# Altium schematic sheet Sheet1.SchDoc
size 241 x 139 mm
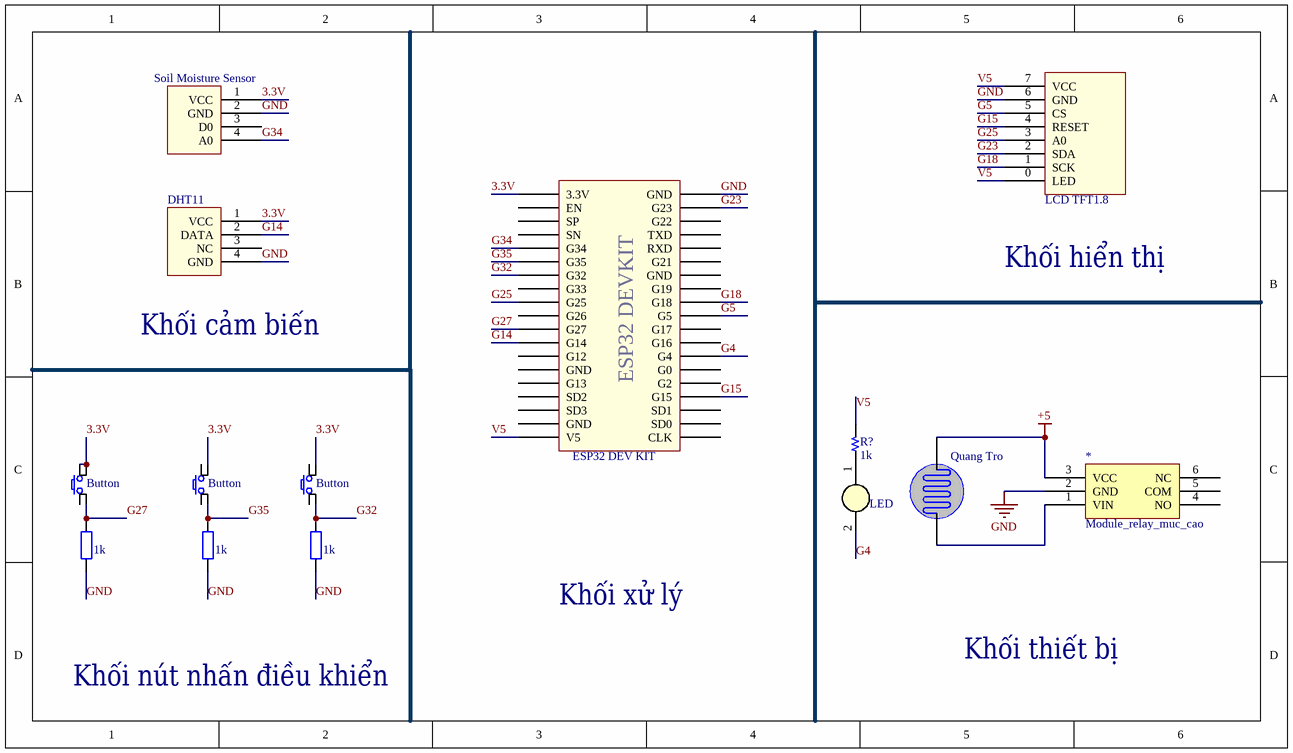
[diagram p0: Sheet1.SchDoc]

## Parts
(Parts that share a designator on the sheet are numbered #1, #2 ... from top to bottom, then left to right.)
*  Module_relay_muc_cao
?#1  LCD TFT1.8
?#2  Soil Moisture Sensor
?#3  DHT11
?#4  ESP32 DEV KIT  [ESP32 DEVKIT]
?#5  LED  [LED-3MM-WHITE]
?#6  Quang Tro  [Quang Tro]
?#7  Button  [SW/4/06MM]
?#8  Button  [SW/4/06MM]
?#9  Button  [SW/4/06MM]
?#10  1k  [tro vach 1/2w]
?#11  1k  [tro vach 1/2w]
?#12  1k  [tro vach 1/2w]
R?  1k  [R 0805]

## Nets
+5: *.3(VCC) ?#6.1
GND: *.2(GND) ?#1.6(GND) ?#2.2(GND) ?#3.4(GND) ?#4.38(GND) ?#10.1 ?#11.1 ?#12.1
3.3V: ?#2.1(VCC) ?#3.1(VCC) ?#4.1(3.3V) ?#7.3 ?#7.4 ?#8.4 ?#9.4
G4: ?#4.26(G4) ?#5.2(K)
G5: ?#1.5(CS) ?#4.29(G5)
G14: ?#3.2(DATA) ?#4.12(G14)
G15: ?#1.4(RESET) ?#4.23(G15)
G18: ?#1.1(SCK) ?#4.30(G18)
G23: ?#1.2(SDA) ?#4.37(G23)
G25: ?#1.3(A0) ?#4.9(G25)
G27: ?#4.11(G27) ?#7.2 ?#10.2
G32: ?#4.7(G32) ?#9.2 ?#12.2
G34: ?#2.4(A0) ?#4.5(G34)
G35: ?#4.6(G35) ?#8.2 ?#11.2
V5: ?#1.0(LED) ?#1.7(VCC) ?#4.19(V5) R?.2
Net*_1: *.1(VIN) ?#6.2
Net?#5_1: ?#5.1(A) R?.1

Not connected (* = marked no-connect by the designer): * 4(NO) 5(COM) 6(NC); ?#2 3(D0); ?#3 3(NC); ?#4 2(EN) 3(SP) 4(SN) 8(G33) 10(G26) 13(G12) 14(GND) 15(G13) 16(SD2) 17(SD3) 18(GND) 20(CLK) 21(SD0) 22(SD1) 24(G2) 25(G0) 27(G16) 28(G17) 31(G19) 32(GND) 33(G21) 34(RXD) 35(TXD) 36(G22); ?#7 1; ?#8 1 3; ?#9 1 3

## Notes on the sheet
- Khối hiển thị
- Khối cảm biến
- Khối xử lý
- Khối nút nhấn điều khiển
- Khối thiết bị
- (in symbol ESP32 DEV KIT) ESP32 DEVKIT

## Library data of the parts
* = Module_relay
?#2 = SoiL_Moisture_Sensor
?#5 = LED 3mm Trang: Cắm; Don_Vi: Con; Ma_Hang: MH009001; Ten_Linh_Kien: LED 3MM Trắng SS (1000c); Ghi_Chu: *; Kieu_Chan: *; Chung_Loai: Cắm
?#6 = Quang Tro: Photoresistor; Creator: Bien Nguyen
?#7-?#9 = SW SPST 4-pin: Tact switch 4-pin
?#10-?#12 = Tro Vach 1/2W 5% 1k: Cắm; Don_Vi: Con; So_Chan: 2; Ten_Linh_Kien: Trở 5% 1/2w 1K; Ma_Hang: MH007240; Chung_Loai: Cắm; Kieu_Chan: *
R? = Resistor